# Altium schematic sheet MT6816_Angle_Encoder.SchDoc
size A4; SheetNumber: 1; SheetTotal: 1
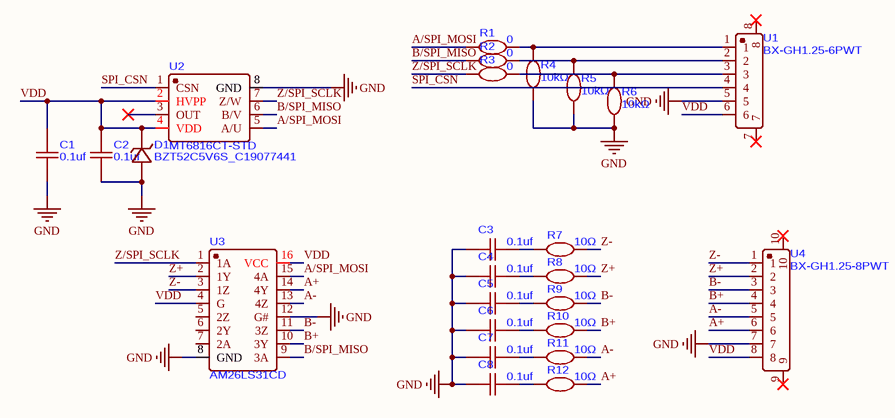
[diagram p0: MT6816_Angle_Encoder.SchDoc]

## Parts
C1  0.1uf  [C0402]
C2  0.1uf  [C0402]
C3  0.1uf  [C0402]
C4  0.1uf  [C0402]
C5  0.1uf  [C0402]
C6  0.1uf  [C0402]
C7  0.1uf  [C0402]
C8  0.1uf  [C0402]
D1  BZT52C5V6S_C19077441  [SOD-323_L1.7-W1.3-LS2.6-RD]
R1  0  [R0402]
R2  0  [R0402]
R3  0  [R0402]
R4  10kΩ  [R0402]
R5  10kΩ  [R0402]
R6  10kΩ  [R0402]
R7  10Ω  [R0402]
R8  10Ω  [R0402]
R9  10Ω  [R0402]
R10  10Ω  [R0402]
R11  10Ω  [R0402]
R12  10Ω  [R0402]
U1  BX-GH1.25-6PWT  [CONN-SMD_6P-P1.25_BX-GH1.25-6PWT]
U2  MT6816CT-STD  [SOP-8_L4.9-W3.9-P1.27-LS6.0-BL]
U3  AM26LS31CD  [SOIC-16_L9.9-W3.9-P1.27-LS6.0-BL]
U4  BX-GH1.25-8PWT  [CONN-SMD_8P-P1.25_BX-GH1.25-8PWT]

## Nets
GND: C1.1 C2.1 C3.1 C4.1 C5.1 C6.1 C7.1 C8.1 D1.2(A) R4.1 R5.1 R6.1 U1.5 U2.8(GND) U3.8(GND) U3.12(G#) U4.7
A+: R12.2 U3.14(4Y) U4.6
A-: R11.2 U3.13(4Z) U4.5
A/SPI_MOSI: R1.2 U2.5(A/U) U3.15(4A)
B+: R10.2 U3.10(3Y) U4.4
B-: R9.2 U3.11(3Z) U4.3
B/SPI_MISO: R2.2 U2.6(B/V) U3.9(3A)
SPI_CSN: U1.4 U2.1(CSN)
VDD: C1.2 C2.2 D1.1(K) U1.6 U2.2(HVPP) U2.4(VDD) U3.4(G) U3.16(VCC) U4.8
Z+: R8.2 U3.2(1Y) U4.2
Z-: R7.2 U3.3(1Z) U4.1
Z/SPI_SCLK: R3.2 U2.7(Z/W) U3.1(1A)
NetC3_2: C3.2 R7.1
NetC4_2: C4.2 R8.1
NetC5_2: C5.2 R9.1
NetC6_2: C6.2 R10.1
NetC7_2: C7.2 R11.1
NetC8_2: C8.2 R12.1
NetR1_1: R1.1 R4.2 U1.1
NetR2_1: R2.1 R5.2 U1.2
NetR3_1: R3.1 R6.2 U1.3

Not connected (* = marked no-connect by the designer): U1 7* 8*; U2 3(OUT)*; U3 5(2Z) 6(2Y) 7(2A); U4 9* 10*

## Library data of the parts
C1-C8 = CC0402KRX6S5BB225
R1-R12 = PTFR0402B30K0P9